# EAGLE design untitled (EAGLE 6.5.0)
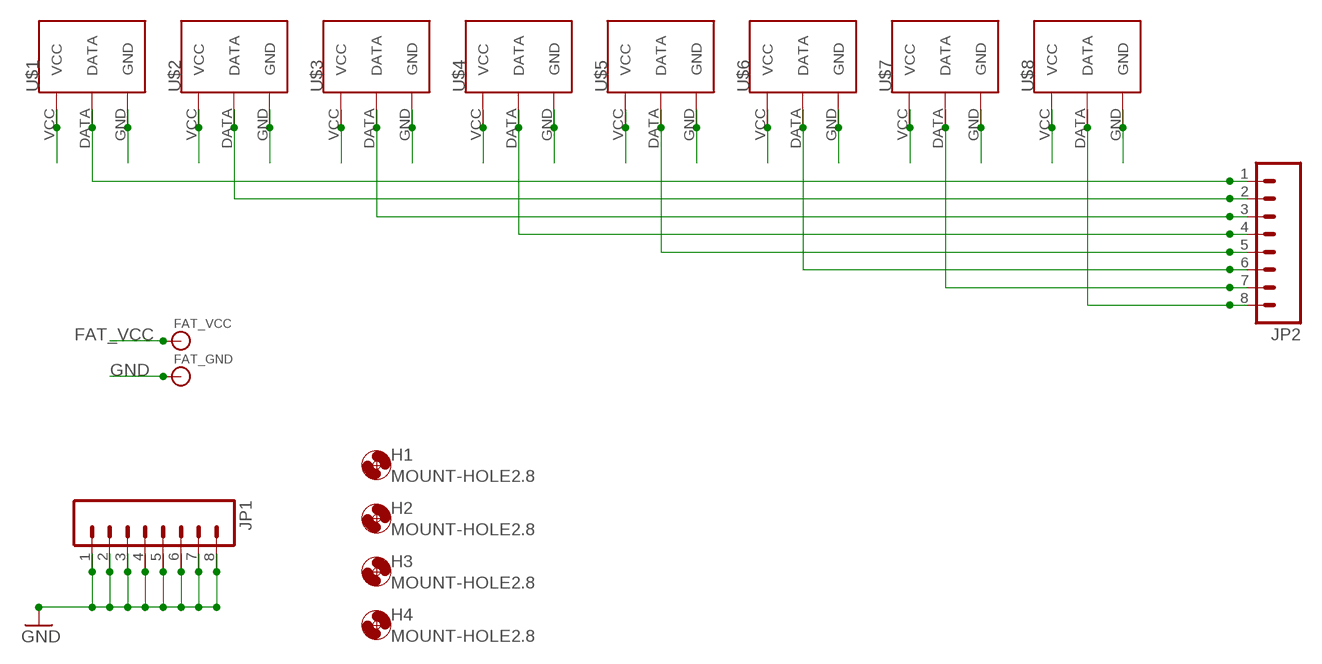
[diagram p0: schematic, sheet 1]

## Parts
FAT_GND  BANANA_CONN  [BANANA_CONN]
FAT_VCC  BANANA_CONN  [BANANA_CONN]
H1  MOUNT-HOLE2.8  [2,8]
H2  MOUNT-HOLE2.8  [2,8]
H3  MOUNT-HOLE2.8  [2,8]
H4  MOUNT-HOLE2.8  [2,8]
JP1  M081X08  [1X08]
JP2  M081X08  [1X08]
U$1  OSTOQ035450  [OSTOQ035450]
U$2  OSTOQ035450  [OSTOQ035450]
U$3  OSTOQ035450  [OSTOQ035450]
U$4  OSTOQ035450  [OSTOQ035450]
U$5  OSTOQ035450  [OSTOQ035450]
U$6  OSTOQ035450  [OSTOQ035450]
U$7  OSTOQ035450  [OSTOQ035450]
U$8  OSTOQ035450  [OSTOQ035450]

## Nets
FAT_VCC: FAT_VCC.P$1 U$1.VCC U$2.VCC U$3.VCC U$4.VCC U$5.VCC U$6.VCC U$7.VCC U$8.VCC
GND: FAT_GND.P$1 JP1.1 JP1.2 JP1.3 JP1.4 JP1.5 JP1.6 JP1.7 JP1.8 U$1.GND U$2.GND U$3.GND U$4.GND U$5.GND U$6.GND U$7.GND U$8.GND
N$1: JP2.1 U$1.DATA
N$2: JP2.2 U$2.DATA
N$3: JP2.3 U$3.DATA
N$4: JP2.4 U$4.DATA
N$5: JP2.5 U$5.DATA
N$6: JP2.6 U$6.DATA
N$7: JP2.7 U$7.DATA
N$8: JP2.8 U$8.DATA

## Notes on the sheet
- FAT_VCC
- GND

## Library data of the parts
FAT_GND FAT_VCC = SparkFun-Connectors:BANANA_CONN: Through-hole banana jack
H1-H4 = holes:MOUNT-HOLE: MOUNTING HOLE with drill center marker
JP1 JP2 = SparkFun-Connectors:M08: Header 8 Standard 8-pin 0.1" header. Use with straight break away headers (SKU : PRT-00116), right angle break away headers (PRT-00553), swiss pins (PRT-00743), machine pins (PRT-00117), and female headers (PRT-00115).
U$1-U$8 = OSTOQ035450:OSTOQ035450

## Board
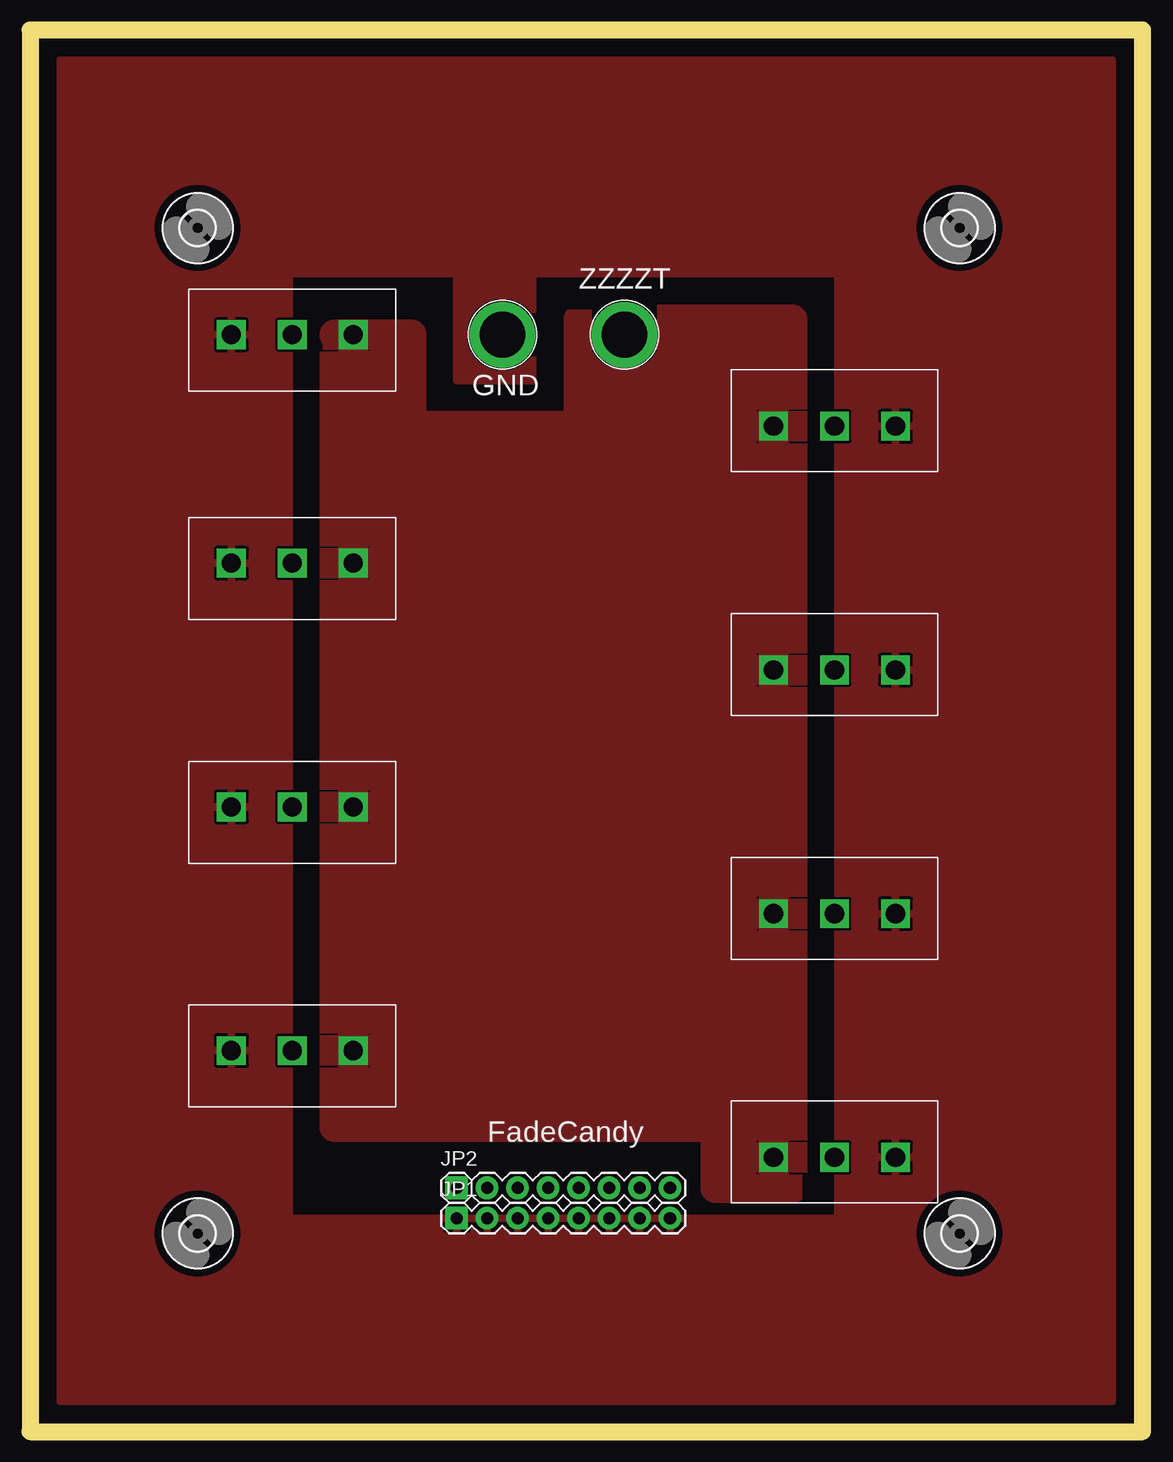
[diagram p1: board, top side]
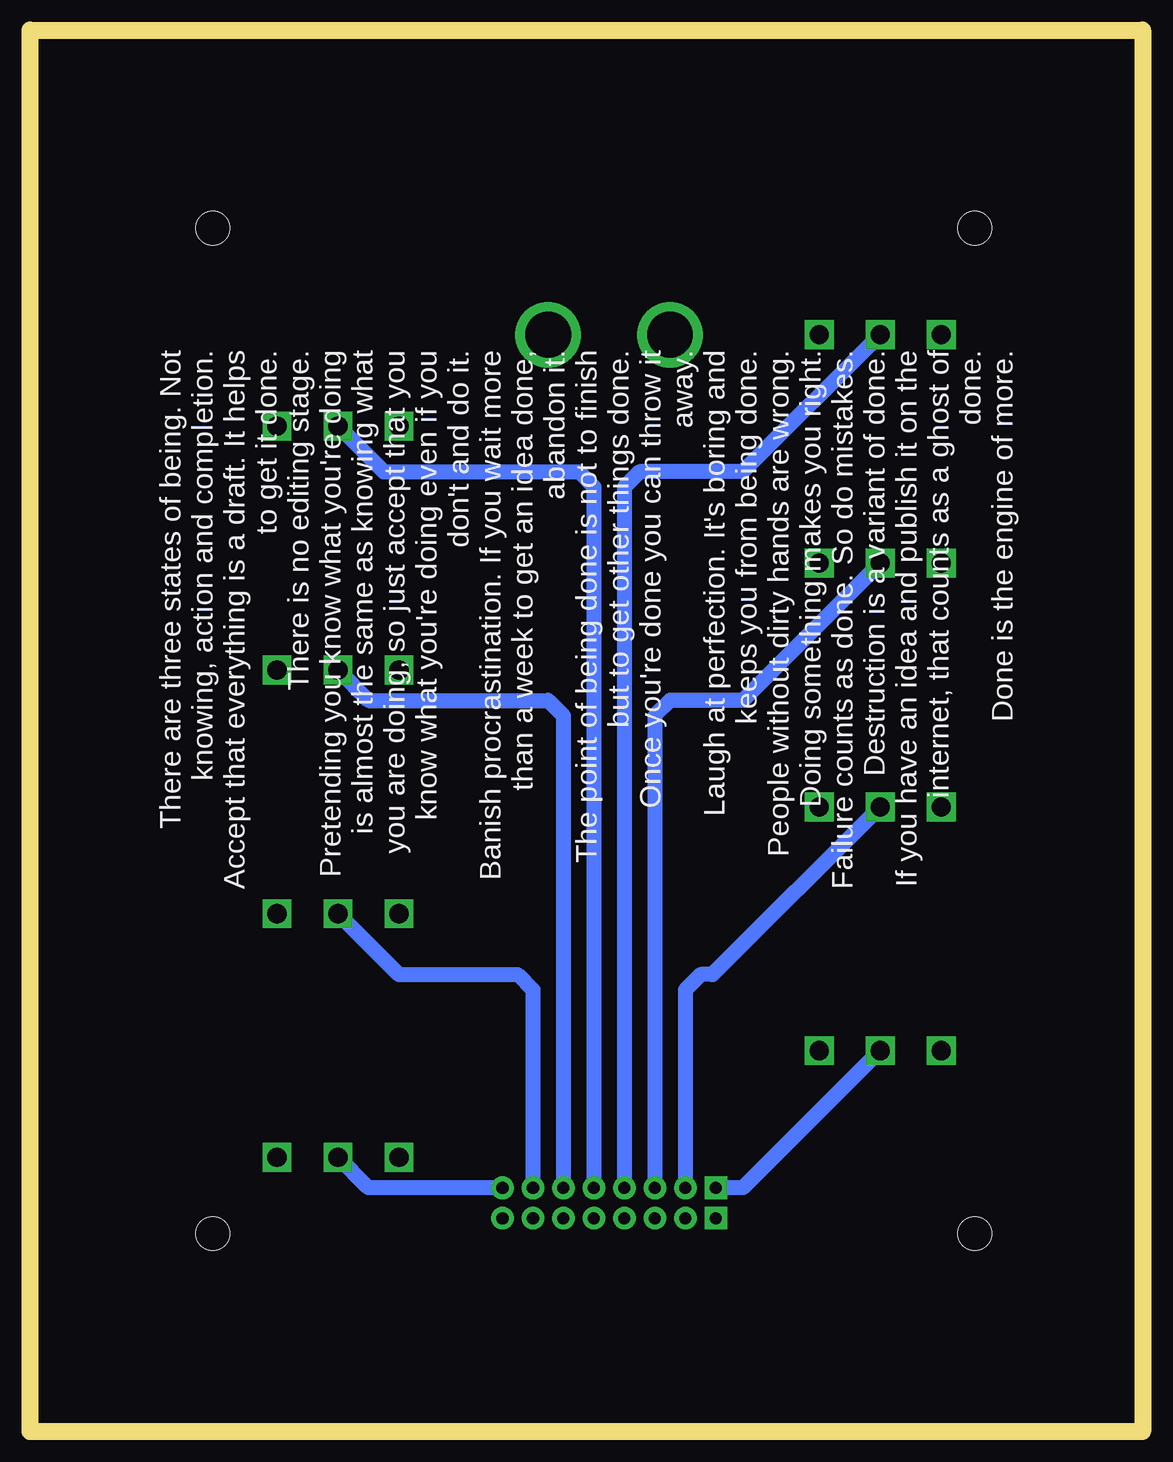
[diagram p2: board, bottom side, seen from below]

Size 92.71 x 116.84 mm. Coordinates in mm from the lower left corner, seen from the top.
Outline: 0,116.84 0,0 92.71,0 92.71,116.84 0,116.84
Copper layers (1*16): Top 0.035mm / dielectric 1.5mm / Bottom 0.035mm
Design rules "default *": minimum track width 10mil, minimum drill 24mil, track to track 8mil, track to pad 8mil, pad to pad 8mil, via to via 8mil, smd to smd 8mil, copper to edge 40mil, drill to drill 8mil, minimum pad ring 10mil, minimum via ring 8mil, stop-mask expansion 4mil, vias tented up to drill 0mil, thermal gap 10mil

### Footprints (pad centres in the part's own frame; a part is rotated, then mirrored left to right if it is on the bottom)
BANANA_CONN = drill 3.81 pad 5.461: P$1 0,0
2,8 = hole 2.8: 0,0
1X08 = drill 1.016 pad 1.88 square: 1 0,0 | drill 1.016 pad 1.88: 2 2.54,0; 3 5.08,0; 4 7.62,0; 5 10.16,0; 6 12.7,0; 7 15.24,0; 8 17.78,0
OSTOQ035450 = drill 1.6 square: DATA 8.62,3.8; GND 13.7,3.8; VCC 3.54,3.8

### Placement (x,y rotation side)
FAT_GND  39.37,91.44 0 top
FAT_VCC  49.53,91.44 0 top
H1  13.97,16.51 0 top
H2  77.47,16.51 0 top
H3  77.47,100.33 0 top
H4  13.97,100.33 0 top
JP1  35.56,17.78 0 top
JP2  35.56,20.32 0 top
U$1  30.48,35.56 180 top
U$2  30.48,55.88 180 top
U$3  30.48,76.2 180 top
U$4  30.48,95.25 180 top
U$5  58.42,80.01 0 top
U$6  58.42,59.69 0 top
U$7  58.42,39.37 0 top
U$8  58.42,19.05 0 top

### Tracks (layer width: path | path; a pad name or v marks a point on that pad's centre or on a via)
FAT_VCC
  Top 1.27: U$2.VCC 26.67,52.35
  pour Top: 25.4,91.44 25.4,25.4 57.15,25.4 57.15,20.32 63.5,20.32 63.5,92.71 45.72,92.71 45.72,83.82 31.75,83.82 31.75,91.44
GND
  pour Top: 21.59,85.09 21.59,96.52 35.56,96.52 35.56,87.63 41.91,87.63 41.91,96.52 67.31,96.52 67.31,17.78 21.59,17.78 21.59,83.82 2.54,83.82 2.54,2.54 90.17,2.54 90.17,114.3 2.54,114.3 2.54,85.09
  pour Top: 21.59,85.09 21.59,83.82 2.54,83.82 2.54,85.09
N$1
  Bottom 1.27: U$1.DATA 33.3,20.32 JP2.1
N$2
  Bottom 1.27: U$2.DATA 35.84,38.1 36.83,38.1 38.1,36.83 JP2.2
N$3
  Bottom 1.27: U$3.DATA 33.3,60.96 39.37,60.96 40.64,59.69 JP2.3
N$4
  Bottom 1.27: U$4.DATA 33.3,80.01 41.91,80.01 43.18,78.74 JP2.4
N$5
  Bottom 1.27: U$5.DATA 63.24,80.01 46.99,80.01 45.72,78.74 JP2.5
N$6
  Bottom 1.27: U$6.DATA 64.51,60.96 49.53,60.96 48.26,59.69 JP2.6
N$7
  Bottom 1.27: U$7.DATA 61.97,38.1 52.07,38.1 50.8,36.83 JP2.7
N$8
  Bottom 1.27: JP2.8 64.51,20.32 U$8.DATA

### Text on the board
tNames: ZZZZT | GND | FadeCandy
bNames: There are three states of being. Not / knowing, action and completion. / Accept that everything is a draft. It helps / to get it done. / There is no editing stage. / Pretending you know what you're doing / is almost the same as knowing what / you are doing, so just accept that you / know what you're doing even if you / don't and do it. / Banish procrastination. If you wait more / than a week to get an idea done, / abandon it. / The point of being done is not to finish / but to get other things done. / Once you're done you can throw it / away. / Laugh at perfection. It's boring and / keeps you from being done. / People without dirty hands are wrong. / Doing something makes you right. / Failure counts as done. So do mistakes. / Destruction is a variant of done. / If you have an idea and publish it on the / internet, that counts as a ghost of / done. / Done is the engine of more.